# EAGLE design night-lamp (EAGLE 9.6.2)
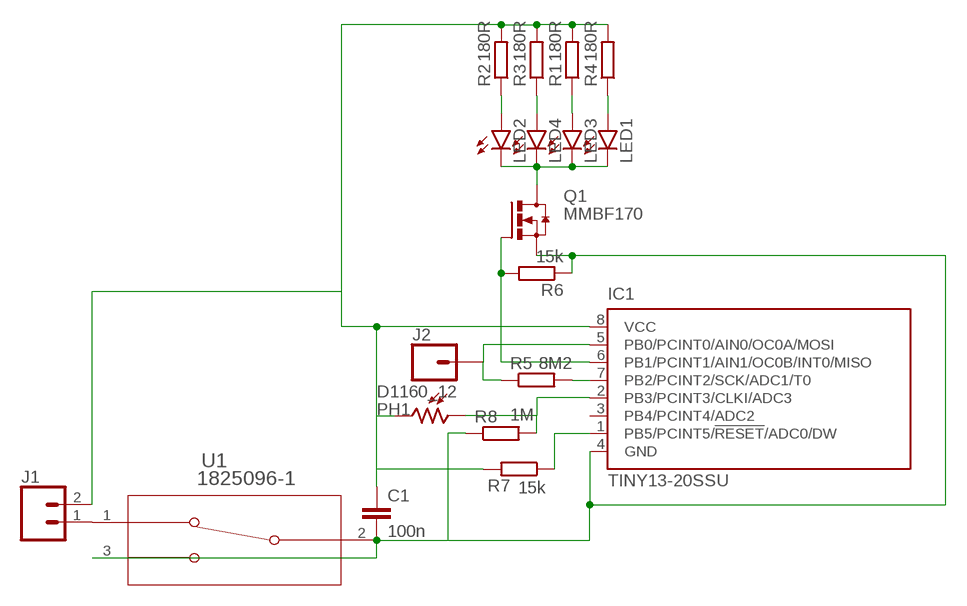
[diagram p0: schematic, sheet 1]

## Parts
C1  100n  C-EUC1206  [C1206]
IC1  TINY13-20SSU  [8S1]
J1  CONN_02  [1X02]
J2  CONN_01  [1X01]
LED1  LED5MM  [LED5MM]
LED2  LED5MM  [LED5MM]
LED3  LED5MM  [LED5MM]
LED4  LED5MM  [LED5MM]
PH1  D1160_12  [D11XX]
Q1  MMBF170  [SOT23]
R1  180R  R-EU_R1206  [R1206]
R2  180R  R-EU_R1206  [R1206]
R3  180R  R-EU_R1206  [R1206]
R4  180R  R-EU_R1206  [R1206]
R5  8M2  R-EU_R1206  [R1206]
R6  15k  R-EU_R1206  [R1206]
R7  15k  R-EU_R1206  [R1206]
R8  1M  R-EU_R1206  [R1206]
U1  1825096-1  [SW3-TOGGLE-2POL_P100]

## Nets
N$1: C1.1 IC1.8(VCC) J1.2 PH1.2 R1.2 R2.2 R3.2 R4.2 R7.2
N$2: C1.2 IC1.4(GND) Q1.2(S) R6.1 R8.1 U1.2 U1.3
N$3: LED2.A R2.1
N$4: LED4.A R3.1
N$5: LED3.A R1.1
N$6: LED1.A R4.1
N$7: LED1.K(C) LED2.K(C) LED3.K(C) LED4.K(C) Q1.3(D)
N$8: IC1.7(PB2/PCINT2/SCK/ADC1/T0) R5.2
N$9: IC1.6(PB1/PCINT1/AIN1/OC0B/INT0/MISO) Q1.1(G) R6.2
N$10: IC1.5(PB0/PCINT0/AIN0/OC0A/MOSI) J2.1 R5.1
N$11: J1.1 U1.1
N$12: IC1.2(PB3/PCINT3/CLKI/ADC3) PH1.1 R8.2
N$13: IC1.1(PB5/PCINT5/!RESET!/ADC0/DW) R7.1
Unconnected: IC1.3(PB4/PCINT4/ADC2)

## Library data of the parts
C1 = rcl:C-EU: CAPACITOR, European symbol; SPICEPREFIX: C
IC1 = atmel:TINY13: 8-bit AVR Microcontroller with 1K Bytes In-System Programmable Flash Source: http://www.atmel.com/dyn/resources/prod_documents/2535S.pdf; MPN: ATTINY13-20SSU; OC_FARNELL: 1455133; OC_NEWARK: 58M3771
J1 = SparkFun-Connectors:CONN_02: Multi connection point. Often used as Generic Header-pin footprint for 0.1 inch spaced/style header connections On any of the 0.1 inch spaced packages, you can populate with these: Break Away Headers - Straight <https://www.sparkfun.com/products/116> (PRT-00116) Break Away Male Headers - Right Angle <https://www.sparkfun.com/products/553> (PRT-00553) Female Headers <https://www.sparkfun.com/products/115> (PRT-00115) Break Away Headers - Machine Pin <https://www.sparkfun.com/products/117> (PRT-00117) Break Away Female Headers - Swiss Machine Pin <https://www.sparkfun.com/products/743> (PRT-00743) For SCREWTERMINALS and SPRING TERMINALS visit here: Screw Terimnals on SparkFun.com <https://www.sparkfun.com/search/results?term=Screw+Terminals> (5mm/3.5mm/2.54mm spacing) This device is also useful as a general connection point to wire up your design to another part of your project. Our various solder wires solder well into these plated through hole pads. Hook-Up Wire - Assortment (Stranded, 22 AWG) <https://www.sparkfun.com/products/11375> (PRT-11375) Hook-Up Wire - Assortment (Solid Core, 22 AWG) <https://www.sparkfun.com/products/11367> (PRT-11367) View the entire wire category on our website here <https://www.sparkfun.com/categories/141> Special notes: Molex polarized connector foot print use with: PRT-08233 with associated crimp pins and housings. 2.54_SCREWTERM for use with PRT-10571. 3.5mm Screw Terminal footprints for PRT-08084 5mm Screw Terminal footprints for use with PRT-08432
J2 = SparkFun-Connectors:CONN_01: Single connection point. Often used as Generic Header-pin footprint for 0.1 inch spaced/style header connections On any of the 0.1 inch spaced packages, you can populate with these: Break Away Headers - Straight <https://www.sparkfun.com/products/116> (PRT-00116) Break Away Male Headers - Right Angle <https://www.sparkfun.com/products/553> (PRT-00553) Female Headers <https://www.sparkfun.com/products/115> (PRT-00115) Break Away Headers - Machine Pin <https://www.sparkfun.com/products/117> (PRT-00117) Break Away Female Headers - Swiss Machine Pin <https://www.sparkfun.com/products/743> (PRT-00743) This device is also useful as a general connection point to wire up your design to another part of your project. Our various solder wires solder well into these plated through hole pads. Hook-Up Wire - Assortment (Stranded, 22 AWG) <https://www.sparkfun.com/products/11375> (PRT-11375) Hook-Up Wire - Assortment (Solid Core, 22 AWG) <https://www.sparkfun.com/products/11367> (PRT-11367) View the entire wire category on our website here <https://www.sparkfun.com/categories/141> Special notes: SMTSO-256-ET is a "flush mount" nut for a 4-40 screw. We mostly use this on specialty testbeds; it is a nice way to connect hardware to your PCB at an adjustable hieght. Also note, the SNAP packages are for using a snappable style connector. We sell a baggie of snaps and they are also used on two LilyPad designs: Snap Assortment - 30 pack (male and female) <https://www.sparkfun.com/products/11347> (DEV-11347) LilyPad Arduino SimpleSnap <https://www.sparkfun.com/products/10941> (DEV-10941) LilyPad SimpleSnap Protoboard <https://www.sparkfun.com/products/10940> (DEV-10940)
LED1-LED4 = led:LED: LED OSRAM: - CHIPLED LG R971, LG N971, LY N971, LG Q971, LY Q971, LO R971, LY R971 LH N974, LH R974 LS Q976, LO Q976, LY Q976 LO Q996 - Hyper CHIPLED LW Q18S LB Q993, LB Q99A, LB R99A - SideLED LS A670, LO A670, LY A670, LG A670, LP A670 LB A673, LV A673, LT A673, LW A673 LH A674 LY A675 LS A676, LA A676, LO A676, LY A676, LW A676 LS A679, LY A679, LG A679 - Hyper Micro SIDELED® LS Y876, LA Y876, LO Y876, LY Y876 LT Y87S - SmartLED LW L88C, LW L88S LB L89C, LB L89S, LG L890 LS L89K, LO L89K, LY L89K LS L896, LA L896, LO L896, LY L896 - TOPLED LS T670, LO T670, LY T670, LG T670, LP T670 LSG T670, LSP T670, LSY T670, LOP T670, LYG T670 LG T671, LOG T671, LSG T671 LB T673, LV T673, LT T673, LW T673 LH T674 LS T676, LA T676, LO T676, LY T676, LB T676, LH T676, LSB T676, LW T676 LB T67C, LV T67C, LT T67C, LS T67K, LO T67K, LY T67K, LW E67C LS E67B, LA E67B, LO E67B, LY E67B, LB E67C, LV E67C, LT E67C LW T67C LS T679, LY T679, LG T679 LS T770, LO T770, LY T770, LG T770, LP T770 LB T773, LV T773, LT T773, LW T773 LH T774 LS E675, LA E675, LY E675, LS T675 LS T776, LA T776, LO T776, LY T776, LB T776 LHGB T686 LT T68C, LB T68C - Hyper Mini TOPLED® LB M676 - Mini TOPLED Santana® LG M470 LS M47K, LO M47K, LY M47K Source: http://www.osram.convergy.de LUXEON: - LUMILED® LXK2-PW12-R00, LXK2-PW12-S00, LXK2-PW14-U00, LXK2-PW14-V00 LXK2-PM12-R00, LXK2-PM12-S00, LXK2-PM14-U00 LXK2-PE12-Q00, LXK2-PE12-R00, LXK2-PE12-S00, LXK2-PE14-T00, LXK2-PE14-U00 LXK2-PB12-K00, LXK2-PB12-L00, LXK2-PB12-M00, LXK2-PB14-N00, LXK2-PB14-P00, LXK2-PB14-Q00 LXK2-PR12-L00, LXK2-PR12-M00, LXK2-PR14-Q00, LXK2-PR14-R00 LXK2-PD12-Q00, LXK2-PD12-R00, LXK2-PD12-S00 LXK2-PH12-R00, LXK2-PH12-S00 LXK2-PL12-P00, LXK2-PL12-Q00, LXK2-PL12-R00 Source: www.luxeon.com KINGBRIGHT: KA-3528ASYC Source: www.kingbright.com
PH1 = photo-elements:D11: Photo Sensor Oil Burner Control Applications Source: http://optoelectronics.perkinelmer.com/content/Datasheets/DTS_PhotocellsD1160.pdf
Q1 = MMBF170:MMBF170: N-MOSFET 500mA 60V SOT23 Check prices <https://pricing.snapeda.com/parts/MMBF170/ON%20Semiconductor/view-part?ref=eda>; AVAILABILITY: In Stock; DESCRIPTION: MOSFET; Transistor Type:MOSFET; Transistor Polarity:N Channel; Drain Source Voltage, Vds:60V; Continuous Drain Current, Id:0.5A; On Resistance, Rds(on):5ohm; Rds(on) Test Voltage, Vgs:10V; Package/Case:SOT-323 ;RoHS Compliant: Yes; MF: ON Semiconductor; MP: MMBF170; PACKAGE: SOT-23 Multicomp; PRICE: None; PURCHASE-URL: https://pricing.snapeda.com/search/part/MMBF170/?ref=eda
R1-R8 = rcl:R-EU_: RESISTOR, European symbol; SPICEPREFIX: R
U1 = Switches:1825096-1; BUILT_BY: EMA_UL_Team; CATEGORY: Pushbutton Switches; COPYRIGHT: Copyright (C) 2016 Accelerated Designs. All rights reserved; DESCRIPTION: TPA11CGPC004; MANUFACTURER_PART_NUMBER: 1825096-1; PART_STATUS: active; SERIES: Unknown; VENDOR: TE Connectivity

## Board
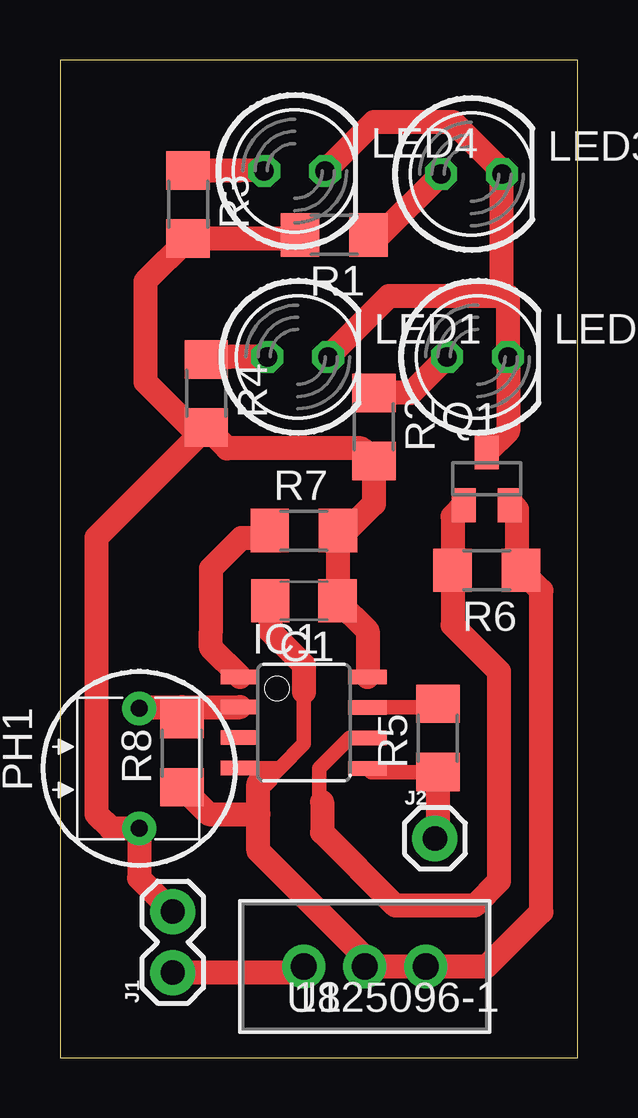
[diagram p1: board, top side]

Size 21.57 x 41.58 mm. Coordinates in mm from the lower left corner, seen from the top.
Outline: 0,0 21.57,0 21.57,41.58 0,41.58 0,0
Copper layers (1*16): Top 0.035mm / dielectric 1.5mm / Bottom 0.035mm
Design rules "default *": minimum track width 0.6mm, minimum drill 0.35mm, track to track 6mil, track to pad 6mil, pad to pad 6mil, via to via 6mil, smd to smd 6mil, copper to edge 40mil, drill to drill 6mil, minimum pad ring 10mil, minimum via ring 8mil, stop-mask expansion 4mil, vias tented up to drill 0mil, thermal gap 10mil

### Footprints (pad centres in the part's own frame; a part is rotated, then mirrored left to right if it is on the bottom)
C1206 = smd 1.6 x 1.8: 1 -1.4,0; 2 1.4,0
8S1 = smd 0.6 x 1.6: 1 -1.905,-2.654; 2 -0.645,-2.654; 3 0.625,-2.654; 4 1.895,-2.654; 5 1.905,2.654; 6 0.635,2.654; 7 -0.635,2.654; 8 -1.905,2.654
1X02 = drill 1.016 pad 1.88: 1 0,0; 2 2.54,0
1X01 = drill 1.016 pad 1.88: 1 0,0
LED5MM = drill 0.813 octagon: A -1.27,0; K 1.27,0
D11XX = drill 0.7 pad 1.4: 1 -2.5,0; 2 2.5,0
SOT23 = smd 1 x 1.4: 1 -0.95,-1.1; 2 0.95,-1.1; 3 0,1.1
R1206 = smd 1.6 x 1.803: 1 -1.422,0; 2 1.422,0
SW3-TOGGLE-2POL_P100 = drill 1.092 pad 1.803: 1 -5.08,0; 2 -2.54,0; 3 0,0

### Placement (x,y rotation side)
C1  10.16,19.05 180 top
IC1  10.16,13.97 270 top
J1  4.7,3.56 90 top
J2  15.62,9.14 0 top
LED1  9.91,29.21 0 top
LED2  17.4,29.21 0 top
LED3  17.14,36.83 0 top
LED4  9.78,36.96 0 top
PH1  3.3,12.06 270 top
Q1  17.78,24.13 0 top
R1  11.43,34.29 180 top
R2  13.08,26.29 270 top
R3  5.33,35.56 270 top
R4  6.1,27.69 270 top
R5  15.75,13.33 90 top
R6  17.78,20.32 180 top
R7  10.16,21.97 0 top
R8  5.08,12.7 90 top
U1  15.24,3.81 0 top

### Tracks (layer width: path | path; a pad name or v marks a point on that pad's centre or on a via)
N$1
  Top 0.6: 11.58,22.12 R7.2 11.43,22.12 | 11.58,19.07 C1.1
  Top 1: R4.2 3.89,24.05 3.39,23.55 1.52,21.68 1.52,10.16 2.11,9.56 PH1.2 3.3,7.49 J1.2 | R1.2 9.86,34.14 R3.2 3.56,32.36 3.56,28.17 5.46,26.26 R4.2 | R4.2 6.25,26.26 | R7.2 11.58,21.59 | 11.58,21.59 11.58,19.07 | C1.1 12.81,17.8 IC1.8 | 11.58,21.59 13.08,23.09 R2.2 12.55,25.4 6.96,25.4 R4.2
N$2
  Top 0.6: IC1.4 8.27,12.07 | 19.3,20.22 R6.1 | 8.27,12.07 8.27,11.43 | 9.15,12.07 8.27,12.07 | 9.15,12.07 10.16,13.08 10.16,15.24 | 9.15,12.07 8.7,11.62
  Top 0.8: 8.27,11.43 8.51,11.43 8.7,11.62
  Top 1: 8.27,10.16 8.27,8.63 12.7,4.19 U1.2 | 8.27,10.16 8.27,11.43 | U1.2 12.83,3.81 | Q1.2 18.88,23.03 19.05,22.86 19.05,20.47 R6.1 20.05,19.47 20.05,6.08 17.78,3.81 U1.3 U1.2 | C1.2 8.76,17.78 10.16,16.38 10.16,15.24 | R8.1 6.2,10.16 8.27,10.16
N$3
  Top 1: LED2.A 14.63,27.71 R2.1
N$4
  Top 1: LED4.A 7.47,36.98 R3.1
N$5
  Top 1: R1.1 13.34,34.29 LED3.A
N$6
  Top 1: R4.1 7.05,29.21 LED1.A
N$7
  Top 1: Q1.3 18.67,26.12 LED2.K 18.67,31.75 18.41,31.75 | 18.41,31.75 LED3.K 18.41,36.96 16.38,38.99 13.08,38.99 LED4.K | LED1.K 13.72,31.75 18.41,31.75
N$8
  Top 0.6: IC1.7 15.6,14.61 R5.2
N$9
  Top 0.6: IC1.6 12.07,13.33 10.8,12.06 10.8,10.79 10.92,10.67
  Top 1: Q1.1 16.36,22.56 R6.2 16.36,18.03 18.29,16.1 18.29,7.37 17.27,6.35 13.97,6.35 10.92,9.4 10.92,10.67
N$10
  Top 0.6: R5.1 12.97,11.91 IC1.5
  Top 1: R5.1 15.75,9.27 J2.1
N$11
  Top 1: U1.1 9.91,3.56 J1.1
N$12
  Top 1: PH1.1 3.35,14.62 5.08,14.62 | 5.08,14.62 IC1.2 | R8.2 5.08,14.62
N$13
  Top 1: R7.1 8.42,21.65 7.56,21.65 6.29,20.38 6.29,17.78 6.29,17.21 6.29,17.09 IC1.1